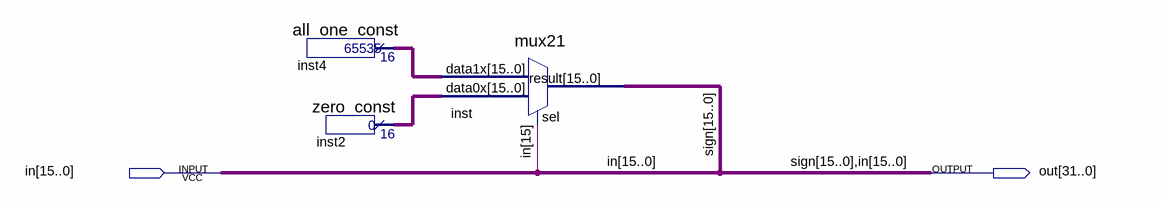
[diagram p0: schematic sheet]
// Quartus schematic sign_extend_16to32.bdf as structural Verilog: 3 symbols, 2 pins
module sign_extend_16to32 (
  input  [15:0] in,
  output [31:0] out
);

  wire [15:0] inst2_result, inst4_result;

  all_one_const inst4 (.result(inst4_result));
  zero_const inst2 (.result(inst2_result));
  mux21 inst (.data1x(inst4_result), .data0x(inst2_result), .sel(in[15]), .result(out[31:16]));

  assign out[15:0] = in;

  // Other names for the same wires on the sheet: sign[15:0] = out[31:16]
endmodule
